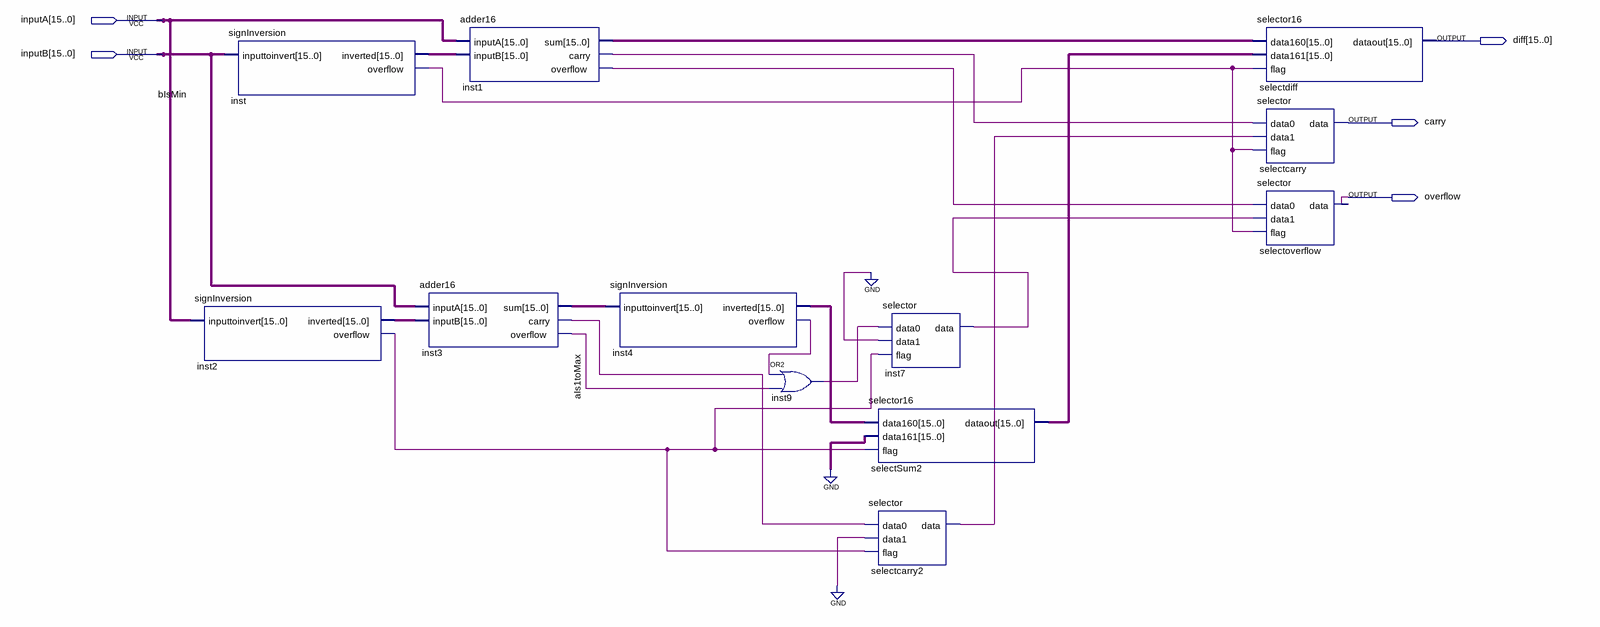
[diagram p0: schematic sheet]
// Quartus schematic subtractor.bdf as structural Verilog: 12 symbols, 5 pins
module subtractor (
  input  [15:0] inputA,
  input  [15:0] inputB,
  output [15:0] diff,
  output carry,
  output overflow
);

  wire aIs1toMax, bIsMin, inst1_carry, inst1_overflow, inst2_overflow, inst3_carry, inst4_overflow,
       inst7_data, inst9_out, selectcarry2_data;
  wire [15:0] inst1_sum, inst2_inverted, inst3_sum, inst4_inverted, inst_inverted, selectSum2_dataout;

  signInversion inst (.inputtoinvert(inputB), .inverted(inst_inverted), .overflow(bIsMin));
  signInversion inst2 (.inputtoinvert(inputA), .inverted(inst2_inverted), .overflow(inst2_overflow));
  adder16 inst3 (.inputA(inputB), .inputB(inst2_inverted), .sum(inst3_sum), .carry(inst3_carry), .overflow(aIs1toMax));
  adder16 inst1 (
    .inputA(inputA), .inputB(inst_inverted), .sum(inst1_sum), .carry(inst1_carry), .overflow(inst1_overflow));
  signInversion inst4 (.inputtoinvert(inst3_sum), .inverted(inst4_inverted), .overflow(inst4_overflow));
  or inst9 (inst9_out, inst4_overflow, aIs1toMax);
  selector inst7 (.data0(inst9_out), .data1(1'b0), .flag(inst2_overflow), .data(inst7_data));
  selector16 selectSum2 (
    .data160(inst4_inverted), .data161({16{1'b0}}), .flag(inst2_overflow), .dataout(selectSum2_dataout));
  selector selectcarry2 (.data0(inst3_carry), .data1(1'b0), .flag(inst2_overflow), .data(selectcarry2_data));
  selector16 selectdiff (.data160(inst1_sum), .data161(selectSum2_dataout), .flag(bIsMin), .dataout(diff));
  selector selectcarry (.data0(inst1_carry), .data1(selectcarry2_data), .flag(bIsMin), .data(carry));
  selector selectoverflow (.data0(inst1_overflow), .data1(inst7_data), .flag(bIsMin), .data(overflow));
endmodule
